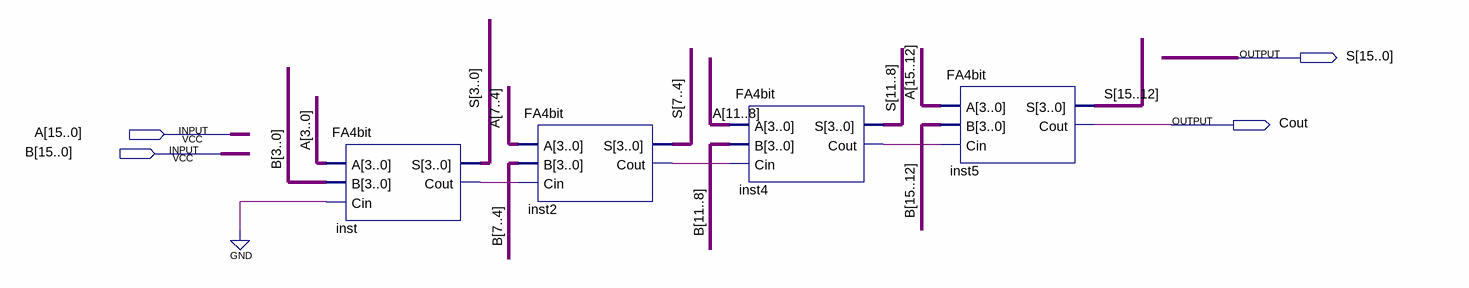
[diagram p0: schematic sheet]
// Quartus schematic FA16bit.bdf as structural Verilog: 4 symbols, 4 pins
module FA16bit (
  input  [15:0] A,
  input  [15:0] B,
  output [15:0] S,
  output Cout
);

  wire inst2_cout, inst4_cout, inst_cout;

  FA4bit inst (.A(A[3:0]), .B(B[3:0]), .Cin(1'b0), .S(S[3:0]), .Cout(inst_cout));
  FA4bit inst2 (.A(A[7:4]), .B(B[7:4]), .Cin(inst_cout), .S(S[7:4]), .Cout(inst2_cout));
  FA4bit inst4 (.A(A[11:8]), .B(B[11:8]), .Cin(inst2_cout), .S(S[11:8]), .Cout(inst4_cout));
  FA4bit inst5 (.A(A[15:12]), .B(B[15:12]), .Cin(inst4_cout), .S(S[15:12]), .Cout(Cout));
endmodule
